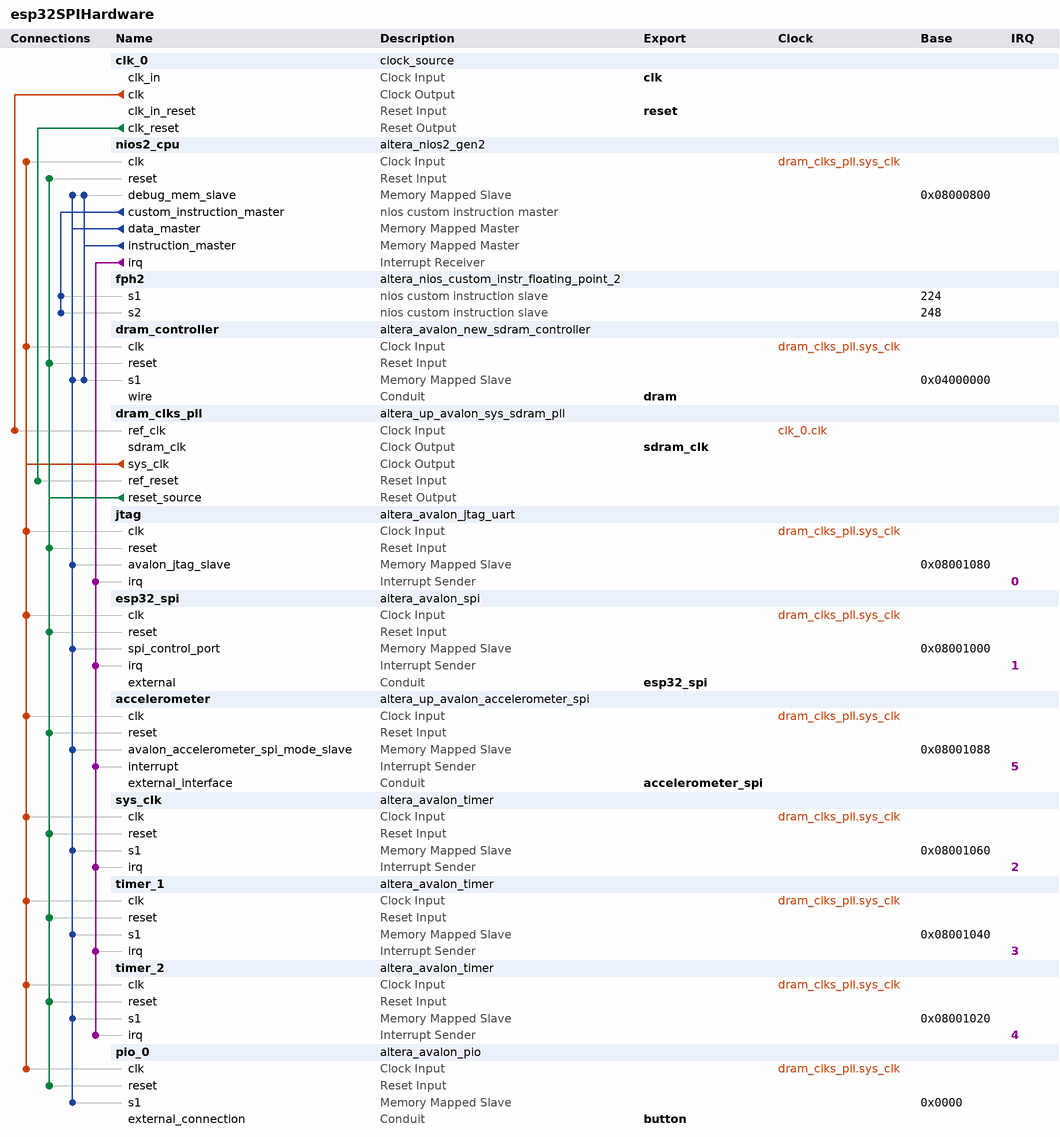
[diagram p0: system contents]
# Platform Designer (Qsys) system esp32SPIHardware, MAX 10 10M50DAF484C7G
# Parameters at their usual value, and those the tool derives, are not listed.
package require -exact qsys 20.1
create_system esp32SPIHardware
set_project_property DEVICE_FAMILY {MAX 10}
set_project_property DEVICE 10M50DAF484C7G

add_instance clk_0 clock_source 20.1
set_instance_parameter_value clk_0 clockFrequency 50000000

add_instance nios2_cpu altera_nios2_gen2 20.1
set_instance_parameter_value nios2_cpu dcache_size 2048
set_instance_parameter_value nios2_cpu exceptionSlave dram_controller.s1
set_instance_parameter_value nios2_cpu icache_size 2048
set_instance_parameter_value nios2_cpu impl Fast
set_instance_parameter_value nios2_cpu resetSlave dram_controller.s1

add_instance fph2 altera_nios_custom_instr_floating_point_2 20.1
set_instance_parameter_value fph2 arithmetic_present true
set_instance_parameter_value fph2 comparison_present true
set_instance_parameter_value fph2 conversion_present true
set_instance_parameter_value fph2 root_present false

add_instance dram_controller altera_avalon_new_sdram_controller 20.1
set_instance_parameter_value dram_controller TAC 5.5
set_instance_parameter_value dram_controller TRCD 20.0
set_instance_parameter_value dram_controller TRP 20.0
set_instance_parameter_value dram_controller casLatency 3
set_instance_parameter_value dram_controller columnWidth 10
set_instance_parameter_value dram_controller dataWidth 16
set_instance_parameter_value dram_controller generateSimulationModel false
set_instance_parameter_value dram_controller model single_Micron_MT48LC4M32B2_7_chip
set_instance_parameter_value dram_controller numberOfBanks 4
set_instance_parameter_value dram_controller numberOfChipSelects 1
set_instance_parameter_value dram_controller powerUpDelay 100.0
set_instance_parameter_value dram_controller refreshPeriod 15.625
set_instance_parameter_value dram_controller rowWidth 13

add_instance dram_clks_pll altera_up_avalon_sys_sdram_pll 18.0
set_instance_parameter_value dram_clks_pll CV_boards DE10-Standard
set_instance_parameter_value dram_clks_pll gui_outclk 50.0
set_instance_parameter_value dram_clks_pll gui_refclk 50.0

add_instance jtag altera_avalon_jtag_uart 20.1
set_instance_parameter_value jtag simInteractiveOptions NO_INTERACTIVE_WINDOWS

add_instance esp32_spi altera_avalon_spi 20.1
set_instance_parameter_value esp32_spi clockPolarity 0
set_instance_parameter_value esp32_spi dataWidth 32
set_instance_parameter_value esp32_spi masterSPI true
set_instance_parameter_value esp32_spi numberOfSlaves 1
set_instance_parameter_value esp32_spi targetClockRate 40000000

add_instance accelerometer altera_up_avalon_accelerometer_spi 18.0

add_instance sys_clk altera_avalon_timer 20.1
set_instance_parameter_value sys_clk period 1
set_instance_parameter_value sys_clk periodUnits MSEC

add_instance timer_1 altera_avalon_timer 20.1
set_instance_parameter_value timer_1 period 1
set_instance_parameter_value timer_1 periodUnits MSEC

add_instance timer_2 altera_avalon_timer 20.1
set_instance_parameter_value timer_2 period 1
set_instance_parameter_value timer_2 periodUnits MSEC

add_instance pio_0 altera_avalon_pio 20.1
set_instance_parameter_value pio_0 direction Input
set_instance_parameter_value pio_0 width 2

# connections
add_connection clk_0.clk dram_clks_pll.ref_clk clock
add_connection dram_clks_pll.sys_clk accelerometer.clk clock
add_connection dram_clks_pll.sys_clk dram_controller.clk clock
add_connection dram_clks_pll.sys_clk esp32_spi.clk clock
add_connection dram_clks_pll.sys_clk jtag.clk clock
add_connection dram_clks_pll.sys_clk nios2_cpu.clk clock
add_connection dram_clks_pll.sys_clk pio_0.clk clock
add_connection dram_clks_pll.sys_clk sys_clk.clk clock
add_connection dram_clks_pll.sys_clk timer_1.clk clock
add_connection dram_clks_pll.sys_clk timer_2.clk clock
add_connection clk_0.clk_reset dram_clks_pll.ref_reset reset
add_connection dram_clks_pll.reset_source accelerometer.reset reset
add_connection dram_clks_pll.reset_source dram_controller.reset reset
add_connection dram_clks_pll.reset_source esp32_spi.reset reset
add_connection dram_clks_pll.reset_source jtag.reset reset
add_connection dram_clks_pll.reset_source nios2_cpu.reset reset
add_connection dram_clks_pll.reset_source pio_0.reset reset
add_connection dram_clks_pll.reset_source sys_clk.reset reset
add_connection dram_clks_pll.reset_source timer_1.reset reset
add_connection dram_clks_pll.reset_source timer_2.reset reset
add_connection nios2_cpu.data_master accelerometer.avalon_accelerometer_spi_mode_slave avalon
set_connection_parameter_value nios2_cpu.data_master/accelerometer.avalon_accelerometer_spi_mode_slave baseAddress 0x08001088
add_connection nios2_cpu.data_master dram_controller.s1 avalon
set_connection_parameter_value nios2_cpu.data_master/dram_controller.s1 baseAddress 0x04000000
add_connection nios2_cpu.data_master esp32_spi.spi_control_port avalon
set_connection_parameter_value nios2_cpu.data_master/esp32_spi.spi_control_port baseAddress 0x08001000
add_connection nios2_cpu.data_master jtag.avalon_jtag_slave avalon
set_connection_parameter_value nios2_cpu.data_master/jtag.avalon_jtag_slave baseAddress 0x08001080
add_connection nios2_cpu.data_master nios2_cpu.debug_mem_slave avalon
set_connection_parameter_value nios2_cpu.data_master/nios2_cpu.debug_mem_slave baseAddress 0x08000800
add_connection nios2_cpu.data_master pio_0.s1 avalon
set_connection_parameter_value nios2_cpu.data_master/pio_0.s1 baseAddress 0x0000
add_connection nios2_cpu.data_master sys_clk.s1 avalon
set_connection_parameter_value nios2_cpu.data_master/sys_clk.s1 baseAddress 0x08001060
add_connection nios2_cpu.data_master timer_1.s1 avalon
set_connection_parameter_value nios2_cpu.data_master/timer_1.s1 baseAddress 0x08001040
add_connection nios2_cpu.data_master timer_2.s1 avalon
set_connection_parameter_value nios2_cpu.data_master/timer_2.s1 baseAddress 0x08001020
add_connection nios2_cpu.instruction_master dram_controller.s1 avalon
set_connection_parameter_value nios2_cpu.instruction_master/dram_controller.s1 baseAddress 0x04000000
add_connection nios2_cpu.instruction_master nios2_cpu.debug_mem_slave avalon
set_connection_parameter_value nios2_cpu.instruction_master/nios2_cpu.debug_mem_slave baseAddress 0x08000800
add_connection nios2_cpu.irq accelerometer.interrupt interrupt
set_connection_parameter_value nios2_cpu.irq/accelerometer.interrupt irqNumber 5
add_connection nios2_cpu.irq esp32_spi.irq interrupt
set_connection_parameter_value nios2_cpu.irq/esp32_spi.irq irqNumber 1
add_connection nios2_cpu.irq jtag.irq interrupt
set_connection_parameter_value nios2_cpu.irq/jtag.irq irqNumber 0
add_connection nios2_cpu.irq sys_clk.irq interrupt
set_connection_parameter_value nios2_cpu.irq/sys_clk.irq irqNumber 2
add_connection nios2_cpu.irq timer_1.irq interrupt
set_connection_parameter_value nios2_cpu.irq/timer_1.irq irqNumber 3
add_connection nios2_cpu.irq timer_2.irq interrupt
set_connection_parameter_value nios2_cpu.irq/timer_2.irq irqNumber 4
add_connection nios2_cpu.custom_instruction_master fph2.s1 nios_custom_instruction
set_connection_parameter_value nios2_cpu.custom_instruction_master/fph2.s1 CIName nios_custom_instr_floating_point_2_0
set_connection_parameter_value nios2_cpu.custom_instruction_master/fph2.s1 baseAddress 224
add_connection nios2_cpu.custom_instruction_master fph2.s2 nios_custom_instruction
set_connection_parameter_value nios2_cpu.custom_instruction_master/fph2.s2 CIName nios_custom_instr_floating_point_2_0_1
set_connection_parameter_value nios2_cpu.custom_instruction_master/fph2.s2 baseAddress 248

# exported interfaces
add_interface accelerometer_spi conduit end
set_interface_property accelerometer_spi EXPORT_OF accelerometer.external_interface
add_interface button conduit end
set_interface_property button EXPORT_OF pio_0.external_connection
add_interface clk clock sink
set_interface_property clk EXPORT_OF clk_0.clk_in
add_interface dram conduit end
set_interface_property dram EXPORT_OF dram_controller.wire
add_interface esp32_spi conduit end
set_interface_property esp32_spi EXPORT_OF esp32_spi.external
add_interface reset reset sink
set_interface_property reset EXPORT_OF clk_0.clk_in_reset
add_interface sdram_clk clock source
set_interface_property sdram_clk EXPORT_OF dram_clks_pll.sdram_clk

set_interconnect_requirement {$system} qsys_mm.clockCrossingAdapter HANDSHAKE
set_interconnect_requirement {$system} qsys_mm.enableEccProtection FALSE
set_interconnect_requirement {$system} qsys_mm.insertDefaultSlave FALSE
set_interconnect_requirement {$system} qsys_mm.maxAdditionalLatency 1

save_system esp32SPIHardware.qsys
